# Altium schematic sheet finalproject_sch.SchDoc
size 594 x 420 mm; SheetNumber: 1; SheetTotal: 1
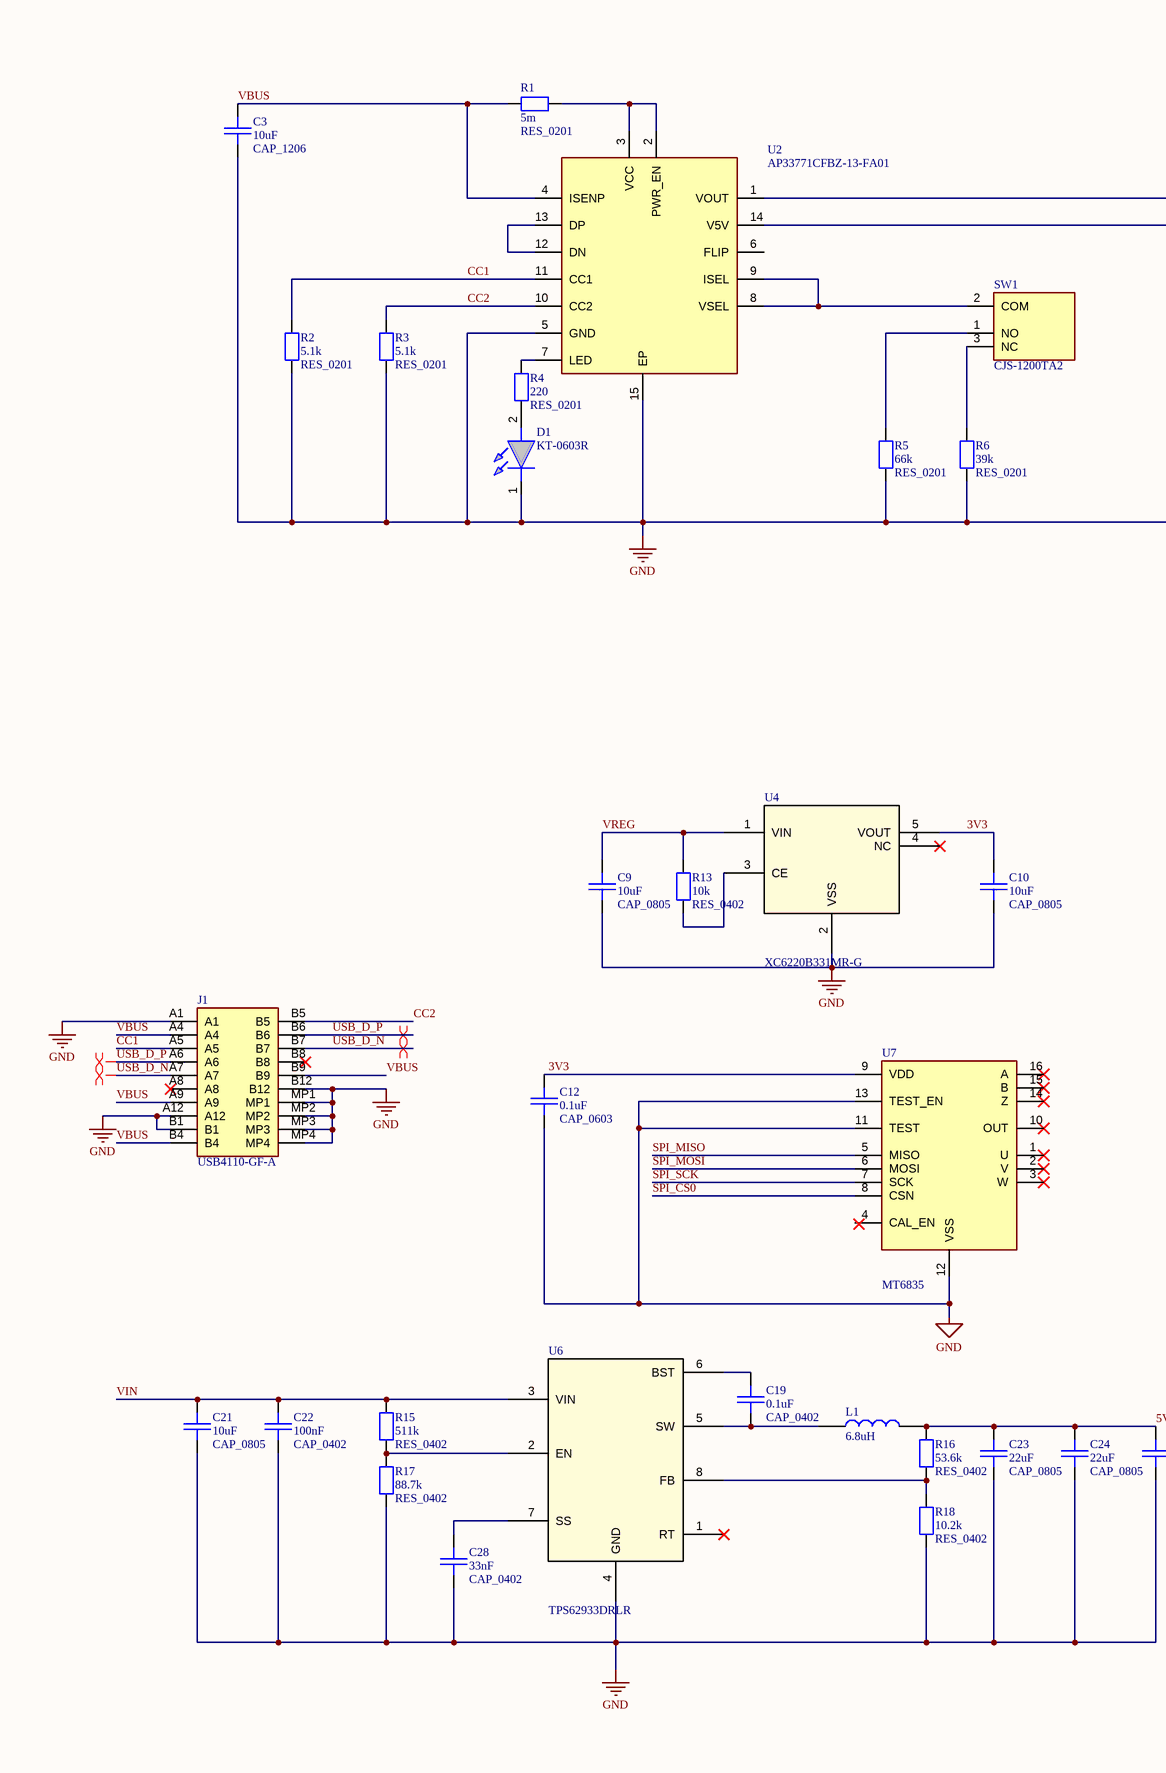
[diagram p0: finalproject_sch.SchDoc, left]
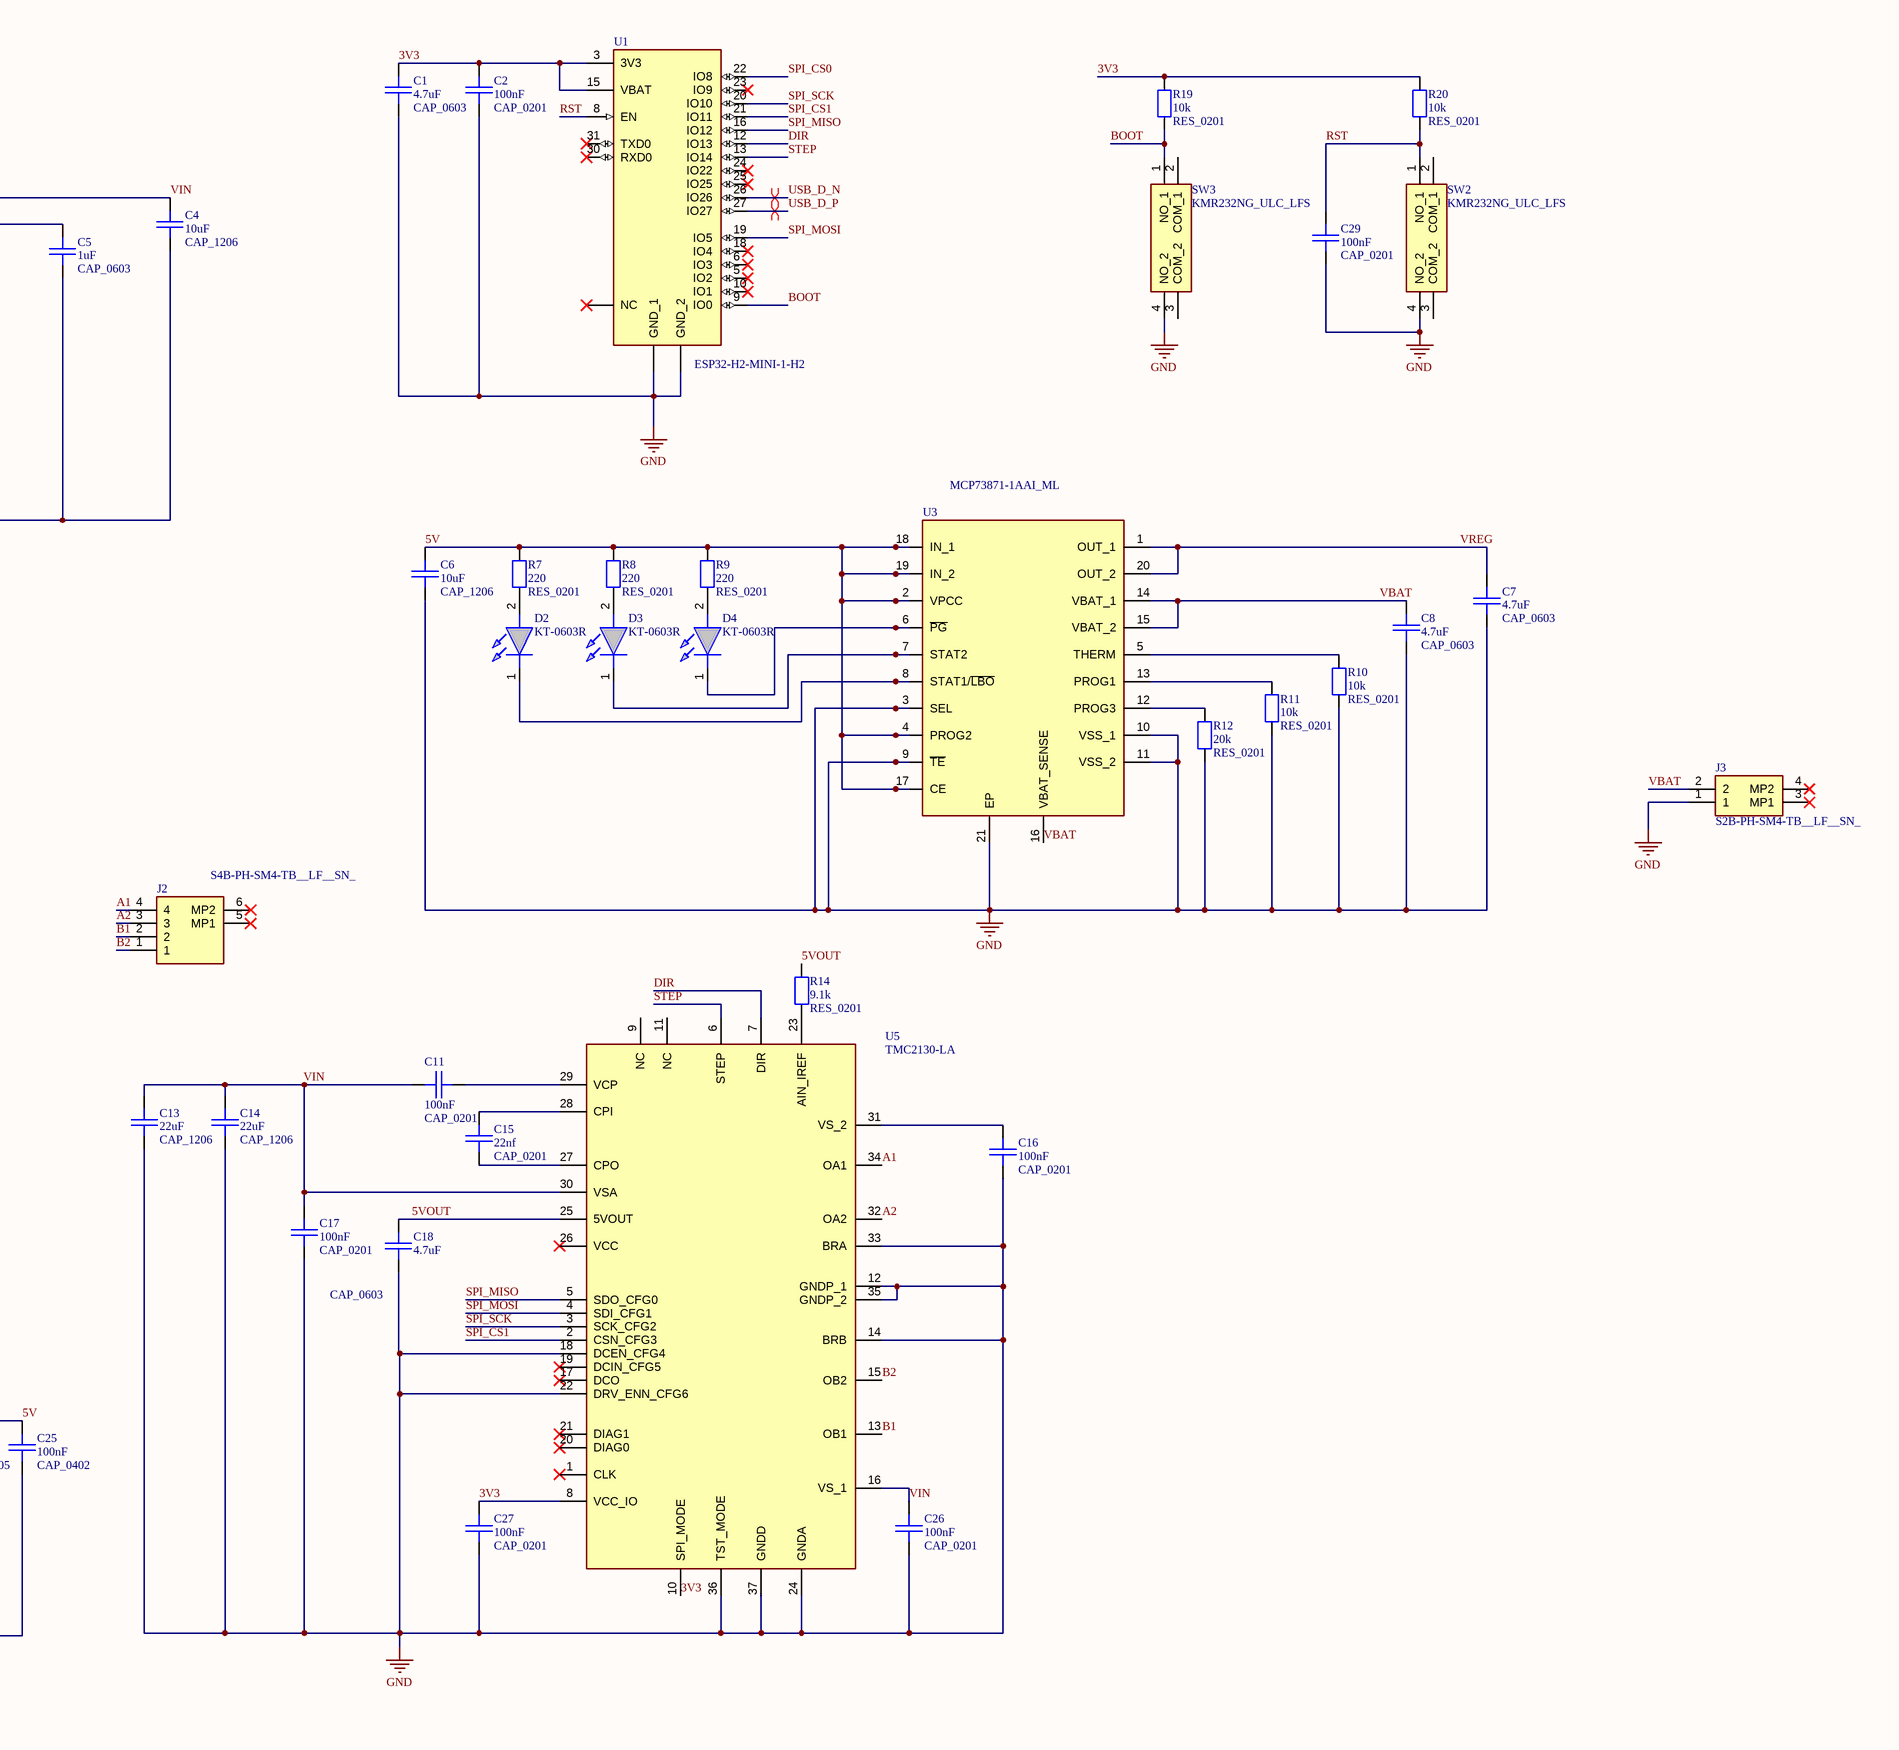
[diagram p1: finalproject_sch.SchDoc, right]

## Parts
C1  CAP_0603  value 4.7uF  [CAP_0603]
C2  CAP_0201  value 100nF  [CAP_0201]
C3  CAP_1206  value 10uF  [CAP_1206]
C4  CAP_1206  value 10uF  [CAP_1206]
C5  CAP_0603  value 1uF  [CAP_0603]
C6  CAP_1206  value 10uF  [CAP_1206]
C7  CAP_0603  value 4.7uF  [CAP_0603]
C8  CAP_0603  value 4.7uF  [CAP_0603]
C9  CAP_0805  value 10uF  [CAP_0805]
C10  CAP_0805  value 10uF  [CAP_0805]
C11  CAP_0201  value 100nF  [CAP_0201]
C12  CAP_0603  value 0.1uF  [CAP_0603]
C13  CAP_1206  value 22uF  [CAP_1206]
C14  CAP_1206  value 22uF  [CAP_1206]
C15  CAP_0201  value 22nf  [CAP_0201]
C16  CAP_0201  value 100nF  [CAP_0201]
C17  CAP_0201  value 100nF  [CAP_0201]
C18  CAP_0603  value 4.7uF  [CAP_0603]
C19  CAP_0402  value 0.1uF  [CAP_0402]
C21  CAP_0805  value 10uF  [CAP_0805]
C22  CAP_0402  value 100nF  [CAP_0402]
C23  CAP_0805  value 22uF  [CAP_0805]
C24  CAP_0805  value 22uF  [CAP_0805]
C25  CAP_0402  value 100nF  [CAP_0402]
C26  CAP_0201  value 100nF  [CAP_0201]
C27  CAP_0201  value 100nF  [CAP_0201]
C28  CAP_0402  value 33nF  [CAP_0402]
C29  CAP_0201  value 100nF  [CAP_0201]
D1  KT-0603R  [LEDC1608X70N]
D2  KT-0603R  [LEDC1608X70N]
D3  KT-0603R  [LEDC1608X70N]
D4  KT-0603R  [LEDC1608X70N]
J1  USB4110-GF-A  [USB4110GFA]
J2  S4B-PH-SM4-TB__LF__SN_  [S4BPHSM4TBLFSN]
J3  S2B-PH-SM4-TB__LF__SN_  [S2BPHSM4TBLFSN]
L1  6.8uH  [74439346068]
R1  RES_0201  value 5m  [RES_0201]
R2  RES_0201  value 5.1k  [RES_0201]
R3  RES_0201  value 5.1k  [RES_0201]
R4  RES_0201  value 220  [RES_0201]
R5  RES_0201  value 66k  [RES_0201]
R6  RES_0201  value 39k  [RES_0201]
R7  RES_0201  value 220  [RES_0201]
R8  RES_0201  value 220  [RES_0201]
R9  RES_0201  value 220  [RES_0201]
R10  RES_0201  value 10k  [RES_0201]
R11  RES_0201  value 10k  [RES_0201]
R12  RES_0201  value 20k  [RES_0201]
R13  RES_0402  value 10k  [RES_0402]
R14  RES_0201  value 9.1k  [RES_0201]
R15  RES_0402  value 511k  [RES_0402]
R16  RES_0402  value 53.6k  [RES_0402]
R17  RES_0402  value 88.7k  [RES_0402]
R18  RES_0402  value 10.2k  [RES_0402]
R19  RES_0201  value 10k  [RES_0201]
R20  RES_0201  value 10k  [RES_0201]
SW1  CJS-1200TA2  [CJS1200TA2]
SW2  KMR232NG_ULC_LFS  [KMR232NGULCLFS]
SW3  KMR232NG_ULC_LFS  [KMR232NGULCLFS]
U1  ESP32-H2-MINI-1-H2  [MODULE_ESP32-H2-MINI-1-H2]
U2  AP33771CFBZ-13-FA01  [AP33771CFBZ13FA01]
U3  MCP73871-1AAI_ML  [QFN50P400X400X100-21N-D]
U4  XC6220B331MR-G  [SOT-25_TOR]
U5  TMC2130-LA  [QFN50P500X600X90-37N]
U6  TPS62933DRLR  [SOT-5X3-8_DRL_TEX]
U7  MT6835  [SOP65P640X120-16N]

## Nets
GND: C1.1 C2.2 C3.1 C4.1 C5.1 C6.1 C7.1 C8.1 C9.1 C10.1 C12.1 C13.1 C14.1 C16.1 C17.1 C18.1 C21.1 C22.1 C23.1 C24.1 C25.1 C26.1 C27.1 C28.1 C29.1 D1.1(K) J1.A1 J1.A12 J1.B1 J1.B12 J1.MP1 J1.MP2 J1.MP3 J1.MP4 J3.1 R2.1 R3.1 R5.2 R6.2 R10.1 R11.1 R12.1 R17.1 R18.1 SW2.4(NO_2) SW3.4(NO_2) U1.1,2,11,14,36,37,38,39,40,41,42,43,44,45,46(GND_1) U1.47,48,49_1,49_2,49_3,49_4,49_5,49_6,49_7,49_9,49_9,50,51,52,53(GND_2) U2.5(GND) U2.15(EP) U3.3(SEL) U3.9(~{TE}) U3.10(VSS_1) U3.11(VSS_2) U3.21(EP) U4.2(VSS) U5.12(GNDP_1) U5.14(BRB) U5.18(DCEN_CFG4) U5.22(DRV_ENN_CFG6) U5.24(GNDA) U5.33(BRA) U5.35(GNDP_2) U5.36(TST_MODE) U5.37(GNDD) U6.4(GND) U7.11(TEST) U7.12(VSS) U7.13(TEST_EN)
3V3: C1.2 C2.1 C10.2 C12.2 C27.2 R19.2 R20.2 U1.3(3V3) U1.15(VBAT) U4.5(VOUT) U5.8(VCC_IO) U5.10(SPI_MODE) U7.9(VDD)
5V: C6.2 C23.2 C24.2 C25.2 L1.2(COIL) R7.2 R8.2 R9.2 R16.2 U3.2(VPCC) U3.4(PROG2) U3.17(CE) U3.18(IN_1) U3.19(IN_2)
5VOUT: C18.2 R14.2 U5.25(5VOUT)
A1: J2.4 U5.34(OA1)
A2: J2.3 U5.32(OA2)
B1: J2.2 U5.13(OB1)
B2: J2.1 U5.15(OB2)
BOOT: R19.1 SW3.1(NO_1) U1.9(IO0)
CC1: J1.A5 R2.2 U2.11(CC1)
CC2: J1.B5 R3.2 U2.10(CC2)
DIR: U1.12(IO13) U5.7(DIR)
RST: C29.2 R20.1 SW2.1(NO_1) U1.8(EN)
SPI_CS0: U1.22(IO8) U7.8(CSN)
SPI_CS1: U1.21(IO11) U5.2(CSN_CFG3)
SPI_MISO: U1.16(IO12) U5.5(SDO_CFG0) U7.5(MISO)
SPI_MOSI: U1.19(IO5) U5.4(SDI_CFG1) U7.6(MOSI)
SPI_SCK: U1.20(IO10) U5.3(SCK_CFG2) U7.7(SCK)
STEP: U1.13(IO14) U5.6(STEP)
USB_D_N: J1.A7 J1.B7 U1.26(IO26)
USB_D_P: J1.A6 J1.B6 U1.27(IO27)
VBAT: C8.2 J3.2 U3.14(VBAT_1) U3.15(VBAT_2) U3.16(VBAT_SENSE)
VBUS: C3.2 J1.A4 J1.A9 J1.B4 J1.B9 R1.1 U2.4(ISENP)
VIN: C4.2 C11.2 C13.2 C14.2 C17.2 C21.2 C22.2 C26.2 R15.2 U2.1(VOUT) U5.16(VS_1) U5.30(VSA) U6.3(VIN)
VREG: C7.2 C9.2 R13.2 U3.1(OUT_1) U3.20(OUT_2) U4.1(VIN)
NetC5_2: C5.2 U2.14(V5V)
NetC11_1: C11.1 U5.29(VCP)
NetC15_1: C15.1 U5.28(CPI)
NetC15_2: C15.2 U5.27(CPO)
NetC16_2: C16.2 U5.31(VS_2)
NetC19_1: C19.1 L1.1(COIL_) U6.5(SW)
NetC19_2: C19.2 U6.6(BST)
NetC28_2: C28.2 U6.7(SS)
NetD1_2: D1.2(A) R4.1
NetD2_1: D2.1(K) U3.8(STAT1/~{LBO})
NetD2_2: D2.2(A) R7.1
NetD3_1: D3.1(K) U3.7(STAT2)
NetD3_2: D3.2(A) R8.1
NetD4_1: D4.1(K) U3.6(~{PG})
NetD4_2: D4.2(A) R9.1
NetR1_2: R1.2 U2.2(PWR_EN) U2.3(VCC)
NetR4_2: R4.2 U2.7(LED)
NetR5_1: R5.1 SW1.1(NO)
NetR6_1: R6.1 SW1.3(NC)
NetR10_2: R10.2 U3.5(THERM)
NetR11_2: R11.2 U3.13(PROG1)
NetR12_2: R12.2 U3.12(PROG3)
NetR13_1: R13.1 U4.3(CE)
NetR14_1: R14.1 U5.23(AIN_IREF)
NetR15_1: R15.1 R17.2 U6.2(EN)
NetR16_1: R16.1 R18.2 U6.8(FB)
NetSW1_2: SW1.2(COM) U2.8(VSEL) U2.9(ISEL)
NetU2_12: U2.12(DN) U2.13(DP)

Not connected (* = marked no-connect by the designer): J1 A8* B8*; J2 5(MP1)* 6(MP2)*; J3 3(MP1)* 4(MP2)*; SW2 2(COM_1) 3(COM_2); SW3 2(COM_1) 3(COM_2); U1 4,7,17,28,29,32,33,34,35(NC)* 5(IO2)* 6(IO3)* 10(IO1)* 18(IO4)* 23(IO9)* 24(IO22)* 25(IO25)* 30(RXD0)* 31(TXD0)*; U2 6(FLIP); U4 4(NC)*; U5 1(CLK)* 9(NC) 11(NC) 17(DCO)* 19(DCIN_CFG5)* 20(DIAG0)* 21(DIAG1)* 26(VCC)*; U6 1(RT)*; U7 1(U)* 2(V)* 3(W)* 4(CAL_EN) 10(OUT)* 14(Z)* 15(B)* 16(A)*

## Layout directives
differential pair: USB_D_N, USB_D_P

## Notes on the sheet
- DWG NO:
- REV:
- THIS DOCUMENT AND THE DATA DISCLOSED HEREIN OR
- HEREWITH IS THE PROPERTY OF ALTIUM LIMITED AND MAY
- BE FREELY DISTRIBUTED IN WHOLE. NO RIGHTS ARE
- RESERVED OR EXPRESS OR IMPLIED WARANTEE GIVEN.
- REVISION
- DESCRIPTION
- DATE
- APPROVED
- ENG:
- APPROVALS
- PROJECT
- DSN:
- CHK:
- REFERENCE DOCUMENTS
- PROJECT REVISION:
- TITLE
- DOCUMENT REVISION:
- DESIGN ITEM:
- BOM:
- FAB DWG:
- PCB DWG:
- ASSY DWG:
- SCALE:
- A2
- SIZE
- CAGE CODE
- FILE NAME
- DWG NO.
- SHEET
- OF
- REV

## Library data of the parts
D1-D4 = KT-0603R: Red 615~630nm 1.9~2.2V 0603 Light Emitting Diodes (LED) RoHS; Manufacturer_Name: Hubei KENTO Elec; Geometry.Height: 0.7mm; Manufacturer_Part_Number: KT-0603R; Mouser Part Number: *; Mouser Price/Stock: *; Arrow Part Number: *; Arrow Price/Stock: *; Datasheet Link: https://datasheet.lcsc.com/szlcsc/Hubei-KENTO-Elec-KT-0603R_C2286.pdf
J1 = USB4110-GF-A: CONN USB 2.0 TYPE-C R/A SMT; Manufacturer_Name: GCT (GLOBAL CONNECTOR TECHNOLOGY); Geometry.Height: 3.26mm; Manufacturer_Part_Number: USB4110-GF-A; Mouser Part Number: 640-USB4110-GF-A; Mouser Price/Stock: https://www.mouser.co.uk/ProductDetail/GCT/USB4110-GF-A?qs=KUoIvG%2F9IlYiZvIXQjyJeA%3D%3D; Arrow Part Number: *; Arrow Price/Stock: *; Datasheet Link: https://gct.co/files/drawings/usb4110.pdf
J2 = S4B-PH-SM4-TB__LF__SN_: Connector Header Surface Mount, Right Angle 4 position 0.079" (2.00mm); Manufacturer_Name: JST (JAPAN SOLDERLESS TERMINALS); Manufacturer_Part_Number: S4B-PH-SM4-TB (LF)(SN); Geometry.Height: 5.5mm; Mouser Part Number: *; Mouser Price/Stock: *; Arrow Part Number: *; Arrow Price/Stock: *; Datasheet Link: https://www.jst-mfg.com/product/pdf/eng/ePH.pdf
J3 = S2B-PH-SM4-TB__LF__SN_: Connector Header Surface Mount, Right Angle 2 position 0.079" (2.00mm); Manufacturer_Name: JST (JAPAN SOLDERLESS TERMINALS); Manufacturer_Part_Number: S2B-PH-SM4-TB (LF)(SN); Geometry.Height: 5.5mm; Mouser Part Number: *; Mouser Price/Stock: *; Arrow Part Number: *; Arrow Price/Stock: *; Datasheet Link: https://www.jst-mfg.com/product/pdf/eng/ePH.pdf
L1 = 74439346068: WE-XHMI SMT Power Inductor Size 6060; L = 6,8 H ; IR = 6,5 A; Isat = 10 A; RDC = 17,6 m; Manufacturer_Name: Wurth Elektronik; Geometry.Height: 6.1mm; Manufacturer_Part_Number: 74439346068; Mouser Part Number: 710-74439346068; Mouser Price/Stock: https://www.mouser.co.uk/ProductDetail/Wurth-Elektronik/74439346068?qs=NSAOzM2zc%2FVj5BeHYKNgfQ%3D%3D; Arrow Part Number: *; Arrow Price/Stock: *; Datasheet Link: https://www.we-online.com/catalog/datasheet/74439346068.pdf
SW1 = CJS-1200TA2: SPDT, ON-ON Slide, 100mA @ 6V DC J-Hook SMD Terminals, T&R 1,000 pc Packaging, Non-washable with tape - Tape and Reel; Manufacturer_Name: Nidec Copal; Geometry.Height: 2.5mm; Manufacturer_Part_Number: CJS-1200TA2; Mouser Part Number: 229-CJS-1200TA2; Mouser Price/Stock: https://www.mouser.co.uk/ProductDetail/Nidec-Components/CJS-1200TA2?qs=XeJtXLiO41Rf26ws0igWdA%3D%3D; Arrow Part Number: *; Arrow Price/Stock: *; Datasheet Link: http://www.nidec-copal-electronics.com/j/catalog/switch/cjs.pdf
SW2 SW3 = KMR232NG_ULC_LFS: Tactile Switch SPST-NO Top Actuated Surface Mount 0.05A @ 32VDC -40C ~ 85C; Manufacturer_Name: C & K COMPONENTS; Manufacturer_Part_Number: KMR232NG ULC LFS; Geometry.Height: 2.7mm; Mouser Part Number: 611-KMR232NGULCLFS; Mouser Price/Stock: https://www.mouser.co.uk/ProductDetail/CK/KMR232NG-ULC-LFS?qs=3gW96gqhLbq2FY2oEdURkw%3D%3D; Arrow Part Number: KMR232NG ULC LFS; Arrow Price/Stock: https://www.arrow.com/en/products/kmr232ngulclfs/ck?region=nac; Datasheet Link: https://www.vishay.com/docs/96283/vs-mbr2035_45ct-m3.pdf
U1 = ESP32-H2-MINI-1-H2: 802.15.4, Bluetooth Bluetooth v5.3, ZigbeeÂ® Transceiver Module 2.4GHz Integrated, Trace Surface Mount; MF: Espressif Systems; SnapEDA_Link: https://www.snapeda.com/parts/ESP32-H2-MINI-1-H2/Espressif+Systems/view-part/?ref=snap; Package: SMD-53 Espressif Systems; MP: ESP32-H2-MINI-1-H2; Check_prices: https://www.snapeda.com/parts/ESP32-H2-MINI-1-H2/Espressif+Systems/view-part/?ref=eda; Value: *
U2 = AP33771CFBZ-13-FA01: Easy-To-Use USB PD3.1 EPR Sink Controller; Manufacturer_Name: Diodes Incorporated; Geometry.Height: 0.8mm; Manufacturer_Part_Number: AP33771CFBZ-13-FA01; Mouser Part Number: 621-P33771CFBZ13FA01; Mouser Price/Stock: https://www.mouser.co.uk/ProductDetail/Diodes-Incorporated/AP33771CFBZ-13-FA01?qs=2wMNvWM5ZX7JpCFGcPz6nw%3D%3D; Arrow Part Number: AP33771CFBZ-13-FA01; Arrow Price/Stock: https://www.arrow.com/en/products/ap33771cfbz-13-fa01/diodes-incorporated?utm_currency=USD&region=nac; Datasheet Link: https://www.diodes.com/datasheet/download/AP33771C.pdf
U3 = MCP73871-1AAI_ML: MICROCHIP - MCP73871-1AAI/ML - USB/AC BATTERY CHARGER WITH POWER PATH MANAGEMENT, 20 QFN 4X4X0.9MM TUBE; Geometry.Height: 1mm; Manufacturer_Name: Microchip; Manufacturer_Part_Number: MCP73871-1AAI/ML; Mouser Part Number: 579-MCP73871-1AAI/ML; Mouser Price/Stock: https://www.mouser.co.uk/ProductDetail/Microchip-Technology/MCP73871-1AAI-ML?qs=wd5RIQLrsJigic%252B62l919g%3D%3D; Arrow Part Number: MCP73871-1AAI/ML; Arrow Price/Stock: https://www.arrow.com/en/products/mcp73871-1aaiml/microchip-technology; Datasheet Link: https://www.arrow.com/en/products/mcp73871-1aaiml/microchip-technology
U4 = XC6220B331MR-G: Description; Manufacturer_Name: Torex Semiconductor; Copyright: Copyright (C) 2025 Ultra Librarian. All rights reserved.; Manufacturer_Part_Number: XC6220B331MR-G; RefDes: RefDes; Type: Type
U5 = TMC2130-LA: Silent stepper motor driver 5 to 46V, up to 1.2A with S/D and SPI Interface, 256 Steps, CoolStep, StallGuard and StealthChop; Manufacturer_Name: Analog Devices; Geometry.Height: 0.9mm; Manufacturer_Part_Number: TMC2130-LA; Mouser Part Number: 700-TMC2130LA; Mouser Price/Stock: https://www.mouser.co.uk/ProductDetail/ADI-Trinamic/TMC2130-LA?qs=TiOZkKH1s2ScTTewbXPgVg%3D%3D; Arrow Part Number: TMC2130-LA; Arrow Price/Stock: https://www.arrow.com/en/products/tmc2130-la/analog-devices?utm_currency=USD&region=nac; Datasheet Link: https://www.analog.com/TMC2130/datasheet
U6 = TPS62933DRLR: 3.8-V to 30-V, 3-A, 200-kHz to 2.2-MHz, low-IQ synchronous buck converter in SOT-583 package 8-SOT-5X3 -40 to 150; Manufacturer_Name: Texas Instruments; Copyright: Copyright (C) 2025 Ultra Librarian. All rights reserved.; Manufacturer_Part_Number: TPS62933DRLR; RefDes: RefDes; Type: Type
U7 = MT6835: 21-Bit High Accuracy Magnetic Angle Encoder IC; Manufacturer_Name: NOVOSENSE; Geometry.Height: 1.2mm; Manufacturer_Part_Number: MT6835; Mouser Part Number: *; Mouser Price/Stock: *; Arrow Part Number: *; Arrow Price/Stock: *; Datasheet Link: https://www.novosns.com/enfiles/MT6835_Rev.1.3.pdf
C1 C5 C7 C8 C12 C18 = CAP_0603: LCSC: *; Tolerance: *; Voltage Rating: *; Capacitor Type: *
C2 C11 C15-C17 C26 C27 C29 = CAP_0201: LCSC: *; Tolerance: *; Voltage Rating: *; Capacitor Type: *
C3 C4 C6 C13 C14 = CAP_1206: LCSC: *; Tolerance: *; Voltage Rating: *; Capacitor Type: *
C9 C10 C21 C23 C24 = CAP_0805: LCSC: *; Tolerance: *; Voltage Rating: *; Capacitor Type: *
C19 C22 C25 C28 = CAP_0402: LCSC: *; Tolerance: *; Voltage Rating: *; Capacitor Type: *
R1-R12 R14 R19 R20 = RES_0201: LCSC: *; Tolerance: *; Voltage Rating: *
R13 R15-R18 = RES_0402: LCSC: *; Tolerance: *; Voltage Rating: *